# EasyEDA Pro project EasyArduino_2025-08-07.epro

# Schematic Schematic1
Board Name: Board1; Create Date: 2025-08-04; Page Name: P1; Project Name: EasyArduino; Schematic Name: Schematic1; Update Date: 2025-08-04; Company: EasyEDA.com; Page Size: A4; Version: V1.0
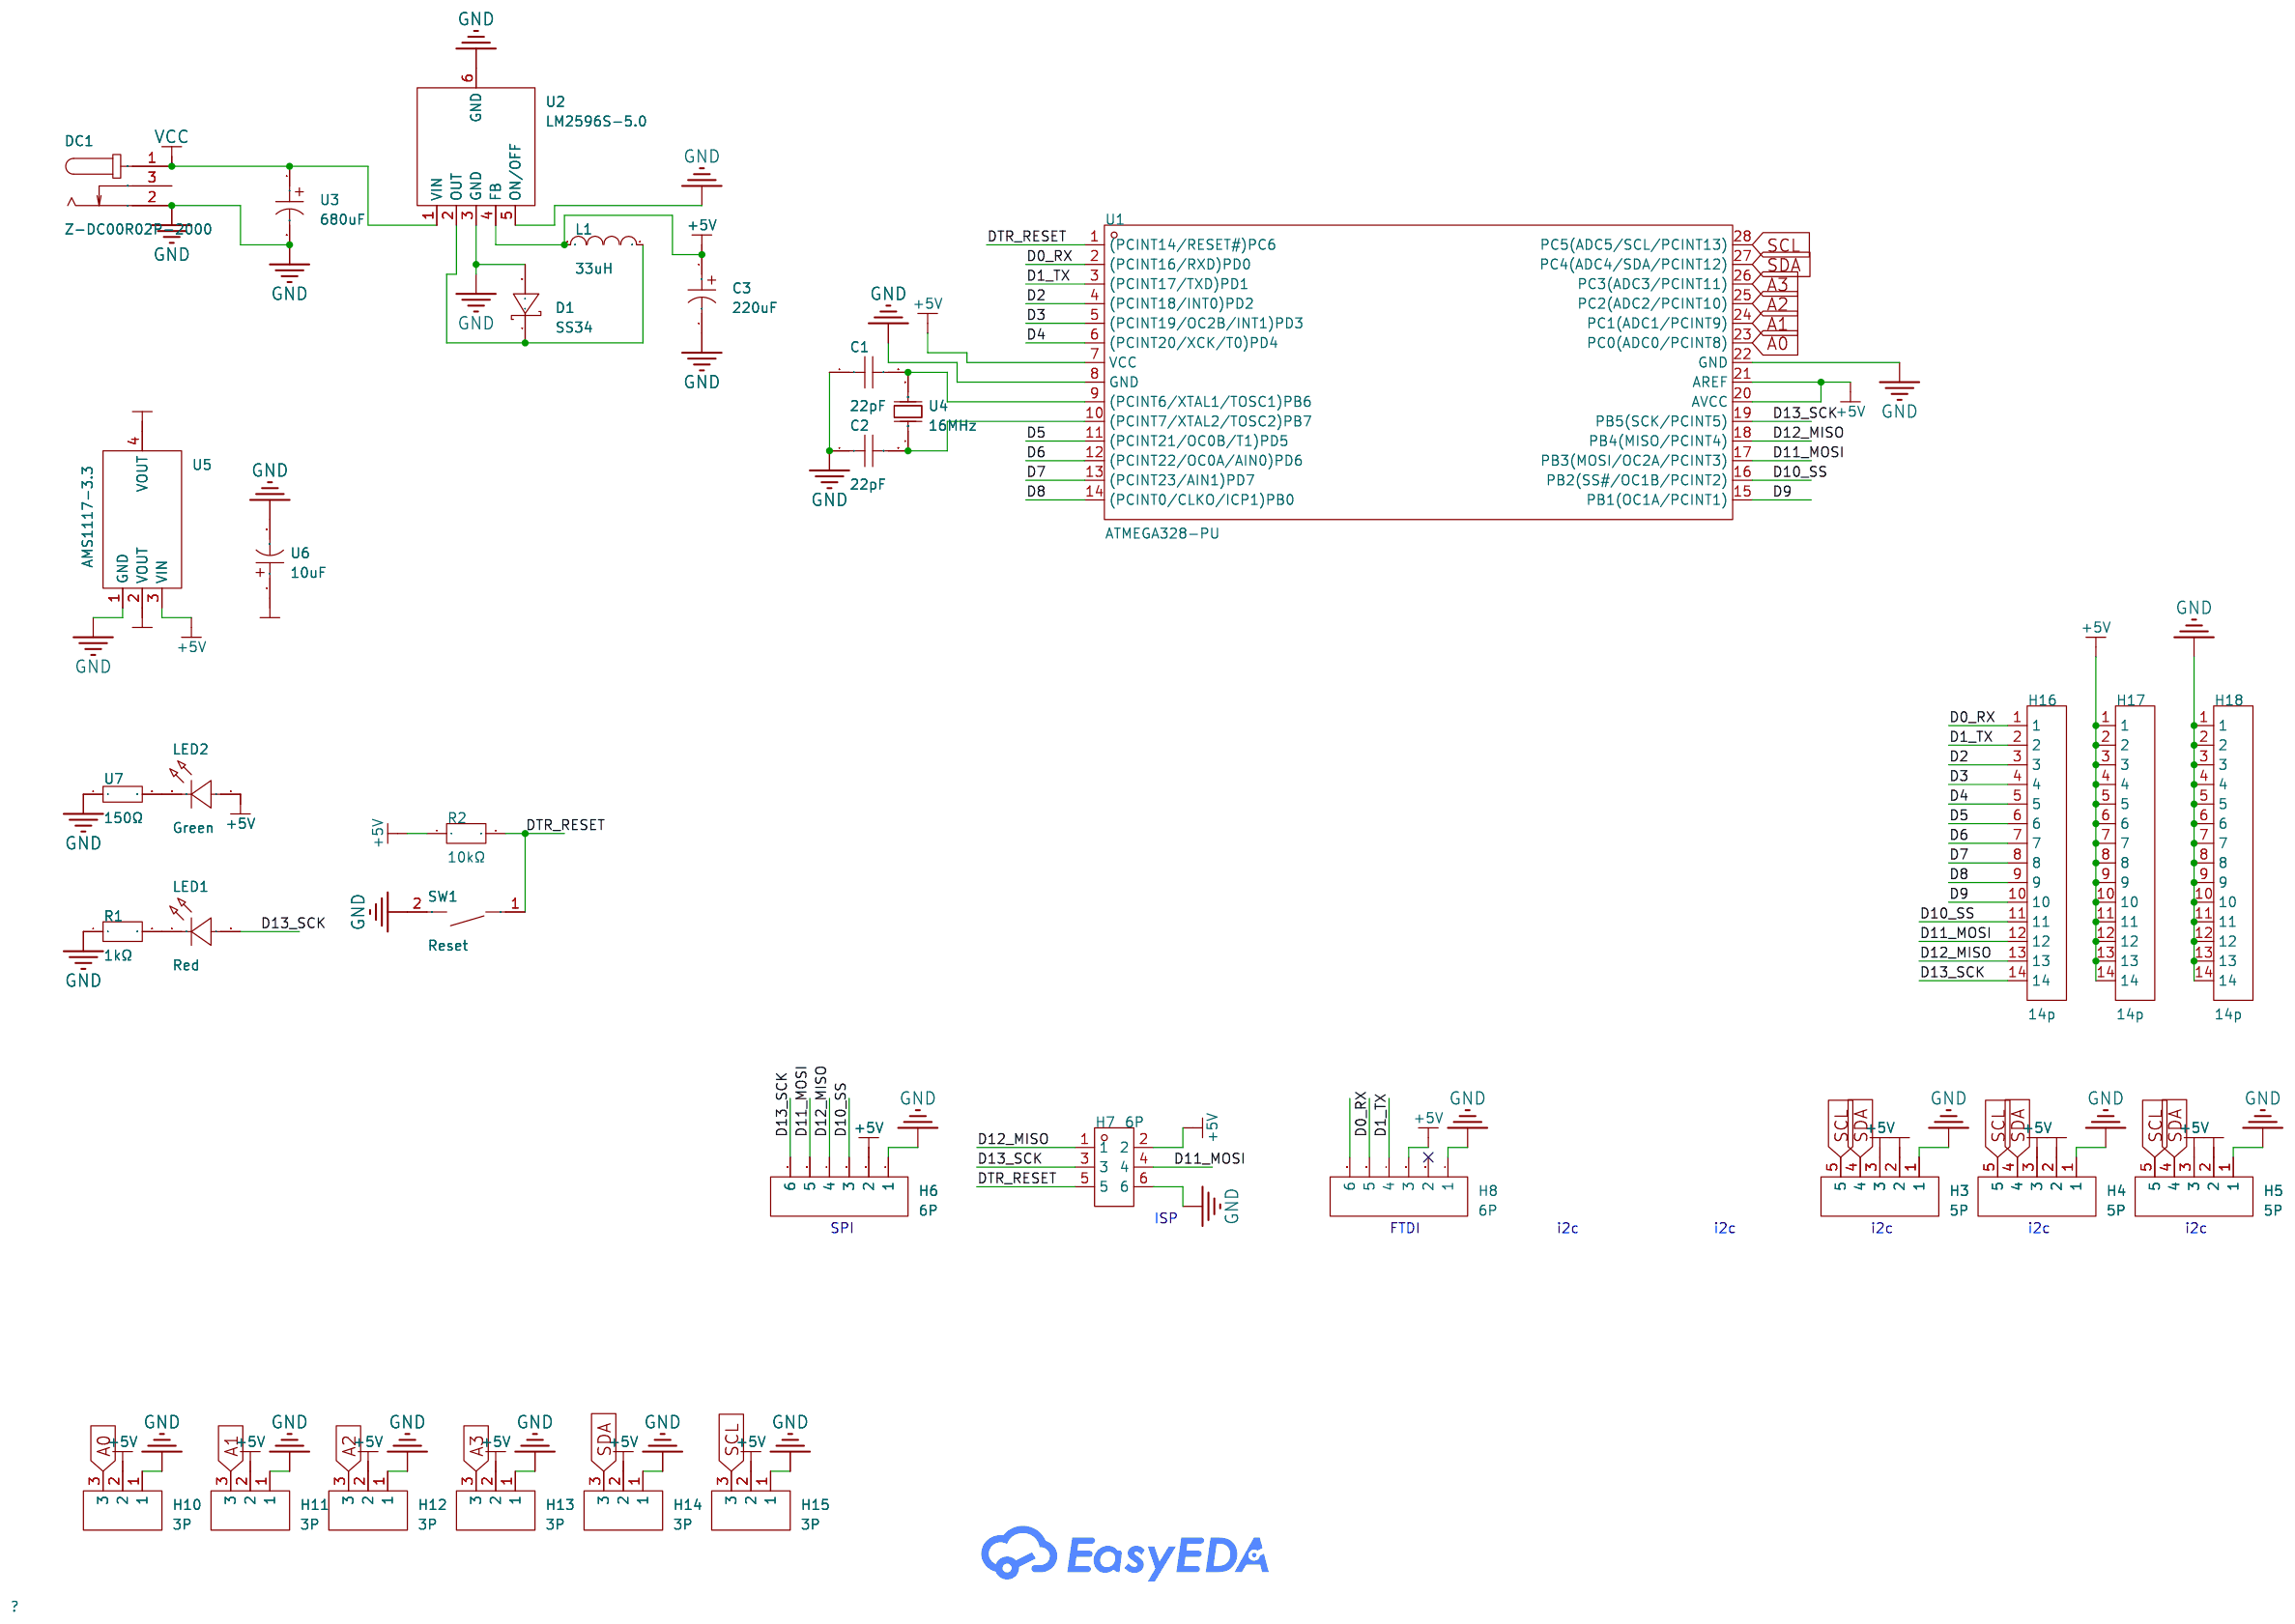
[diagram p0: schematic sheet]

## Parts
C1  22pF  [CAP-TH_L4.0-W2.6-P2.50-D0.5]
C2  22pF  [CAP-TH_L4.0-W2.6-P2.50-D0.5]
C3  220uF  [CAP-SMD_BD6.3-L6.6-W6.6-FD]
D1  SS34  [SMA_L4.4-W2.8-LS5.4-RD]
DC1  Z-DC00R02P-2000  [DC-IN-TH_DC005]
H3  5P  [HDR-TH_5P-P2.54-V-M]
H4  5P  [HDR-TH_5P-P2.54-V-M]
H5  5P  [HDR-TH_5P-P2.54-V-M]
H6  6P  [HDR-TH_6P-P2.54-V-M-1]
H7  6P  [HDR-TH_6P-P2.54-V-M-R2-C3-S2.54]
H8  6P  [HDR-TH_6P-P2.54-V-M-1]
H10  3P  [HDR-TH_3P-P2.54-V-M]
H11  3P  [HDR-TH_3P-P2.54-V-M]
H12  3P  [HDR-TH_3P-P2.54-V-M]
H13  3P  [HDR-TH_3P-P2.54-V-M]
H14  3P  [HDR-TH_3P-P2.54-V-M]
H15  3P  [HDR-TH_3P-P2.54-V-M]
H16  14p  [HDR-TH_14P-P2.54-V-M]
H17  14p  [HDR-TH_14P-P2.54-V-M]
H18  14p  [HDR-TH_14P-P2.54-V-M]
L1  33uH  [IND-SMD_L12.3-W12.3]
LED1  Red  [LED-TH_BD3.8-P2.54-RD]
LED2  Green  [LED-TH_BD3.8-P2.54-FD_GREEN]
R1  1kΩ  [RES-TH_BD2.7-L6.2-P10.20-D0.4]
R2  10kΩ  [RES-TH_BD2.4-L6.3-P10.30-D0.6]
SW1  Reset  [SW-SMD_L3.9-W3.0-P4.45]
U1  ATMEGA328-PU  [DIP-28_L35.0-W6.5-P2.54-LS7.6-BL]
U2  LM2596S-5.0  [TO-263-5_L10.2-W8.6-P1.70-LS14.4-BR]
U3  680uF  [CAP-SMD_BD10.0-L10.3-W10.3-LS11.6-FD]
U4  16MHz  [HC-49US_L11.0-W4.6-P4.88]
U5  AMS1117-3.3  [SOT-223-3_L6.5-W3.4-P2.30-LS7.0-BR]
U6  10uF  [CAP-SMD_BD4.0-L4.3-W4.3-FD-LS4.8]
U7  150Ω  [RES-TH_BD2.7-L6.2-P10.20-D0.4]

## Library data of the parts
C1 C2 = K220J15C0GF5TL2: Capacitance:22pF Tolerance:±5% Tolerance:±5% Voltage Rating:50V Temperature Coefficient:C0G; LCSC Part Name: 22pF ±5% 50V; Supplier Part: C2170230; Manufacturer: VISHAY(威世); Supplier Footprint: 插件,P=2.5mm; JLCPCB Part Class: Extended Part; Datasheet: https://atta.szlcsc.com/upload/public/pdf/source/20210702/6531D680143ED60327F22057485455BA.pdf; Supplier: LCSC; Tolerance: ±5%; Voltage Rating: 50V; Temperature Coefficient: C0G
C3 = 189RV0063: Capacitance:220uF Tolerance:±20% Tolerance:±20% Voltage Rating:16V Ripple Current:110mA Diameter:6.3mm Height - Seated (Max):7.7mm Lifetime:2000hrs@105℃ Operating Temperature:-55℃~+105℃ Operating Temperature:-55℃~+105℃; LCSC Part Name: 220uF ±20% 16V; Supplier Part: C18203143; Manufacturer: KNSCHA(科尼盛); Supplier Footprint: SMD,D6.3xL7.7mm; JLCPCB Part Class: Extended Part; Datasheet: https://atta.szlcsc.com/upload/public/pdf/source/20231020/6819E00089B8FE8D9330F875BB68A445.pdf; Supplier: LCSC; Tolerance: ±20%; Voltage Rating: 16V; Ripple Current: 110mA; Diameter: 6.3mm; Height - Seated (Max): 7.7mm; Lifetime: 2000hrs@105℃; Operating Temperature: -55℃~+105℃
D1 = SS34: Forward Voltage (Vf@If):500mV@3A Reverse Voltage (Vr):40V Average Rectified Current (Io):3A; LCSC Part Name: 电压:40V 电流:3A; Supplier Part: C142458; Supplier Footprint: SMA(DO-214AC); JLCPCB Part Class: Extended Part; Datasheet: https://atta.szlcsc.com/upload/public/pdf/source/20171114/C142458_15106326937931117548.pdf; Supplier: LCSC; Forward Voltage (Vf@If): 500mV@3A; Reverse Voltage (Vr): 40V; Average Rectified Current (Io): 3A
DC1 = Z-DC00R02P-2000: Inside Contact Diameter:2mm Outside Contact Diameter:6.3mm Current Rating (Max):500mA Voltage Rating (Max):30V; LCSC Part Name: 内径:2mm 外径:6.3mm; Supplier Part: C132516; Manufacturer: Ckmtw(灿科盟); Supplier Footprint: 插件; JLCPCB Part Class: Extended Part; Datasheet: https://atta.szlcsc.com/upload/public/pdf/source/20180105/C132516_15151572879811234526.pdf; Supplier: LCSC; Inside Contact Diameter: 2mm; Outside Contact Diameter: 6.3mm; Current Rating (Max): 500mA; Voltage Rating (Max): 30V
H3-H5 = PZ254V-11-05P: Pin Structure:1x5P Pitch:2.54mm Row Spacing:- Circluar Pins/Square Pins:Policy Mounting Type:Straight Number of Rows:Single Row Number of Pins:5P Current Rating:- Voltage Rating (Max):- Length of Mating Pin:6mm Insulation Height:2.5mm Length of End Connec; LCSC Part Name: 1x5P 间距:2.54mm 方针 直插; Supplier Part: C492404; Manufacturer: XFCN(兴飞); Supplier Footprint: 插件,P=2.54mm; JLCPCB Part Class: Extended Part; Datasheet: https://atta.szlcsc.com/upload/public/pdf/source/20200309/C492404_E51533260F8710EFF5D4617281164C1D.pdf; Supplier: LCSC; Pin Structure: 1x5P; Pitch: 2.54mm; Circluar Pins/Square Pins: Policy; Mounting Type: Straight; Number of Rows: Single Row; Length of Mating Pin: 6mm; Insulation Height: 2.5mm; Length of End Connection Pin: 3mm; Contact Material: Brass; Operating Temperature: -40℃~+105℃; Color: Black
H6 H8 = 2.54-1x6P直针: Pin Structure:1x6P Pitch:2.54mm Row Spacing:- Circluar Pins/Square Pins:Policy Mounting Type:Straight Number of Rows:Single Row Number of Pins:6P Current Rating:3A Voltage Rating (Max):- Length of Mating Pin:- Insulation Height:- Contact Material:Brass Co; LCSC Part Name: 1x6P 间距:2.54mm 方针 直插; Supplier Part: C37208; Manufacturer: BOOMELE(博穆精密); Supplier Footprint: 插件,P=2.54mm; JLCPCB Part Class: Extended Part; Datasheet: https://atta.szlcsc.com/upload/public/pdf/source/20250115/42A019761A40C8B839643401D8CA5A96.pdf; Supplier: LCSC; Pin Structure: 1x6P; Pitch: 2.54mm; Circluar Pins/Square Pins: Policy; Mounting Type: Straight; Number of Rows: Single Row; Current Rating: 3A; Contact Material: Brass; Operating Temperature: -40℃~+105℃; Color: Black
H7 = PZ254V-12-6P: Pin Structure:2x3P Pitch:2.54mm Row Spacing:2.54mm Circluar Pins/Square Pins:Square Pins Mounting Type:Straight Number of Rows:双排 Number of Pins:6P Current Rating (Max):- Voltage Rating (Max):- Length of Mating Pin:6mm Insulation Height:2.5mm Length of En; LCSC Part Name: 间距:2.54mm 2x3P 直插 方针; Supplier Part: C492420; Manufacturer: XFCN(兴飞); Supplier Footprint: 插件,P=2.54mm; JLCPCB Part Class: Extended Part; Datasheet: https://atta.szlcsc.com/upload/public/pdf/source/20200309/C492420_BAECB307B001054C09D200388220EAE6.pdf; Supplier: LCSC; Pin Structure: 2x3P; Pitch: 2.54mm; Row Spacing: 2.54mm; Circluar Pins/Square Pins: Square Pins; Mounting Type: Straight; Number of Rows: 双排; Length of Mating Pin: 6mm; Insulation Height: 2.5mm; Length of End Connection Pin: 3mm; Operating Temperature Range: -40℃~+105℃; Color: Black
H10-H15 = PZ254V-11-03P: Pin Structure:1x3P Pitch:2.54mm Row Spacing:- Circluar Pins/Square Pins:Policy Mounting Type:Straight Number of Rows:Single Row Number of Pins:3P Current Rating:3A Voltage Rating (Max):250V Length of Mating Pin:6mm Insulation Height:2.5mm Length of End Co; LCSC Part Name: 1x3P 间距:2.54mm 方针 直插; Supplier Part: C2937625; Manufacturer: XFCN(兴飞); Supplier Footprint: 插件,P=2.54mm; JLCPCB Part Class: Extended Part; Datasheet: https://atta.szlcsc.com/upload/public/pdf/source/20200309/C492402_8335C3D49C4E4C618838D59BB1D024C1.pdf; Supplier: LCSC; Pin Structure: 1x3P; Pitch: 2.54mm; Circluar Pins/Square Pins: Policy; Mounting Type: Straight; Number of Rows: Single Row; Current Rating: 3A; Voltage Rating (Max): 250V; Length of Mating Pin: 6mm; Insulation Height: 2.5mm; Length of End Connection Pin: 3mm; Operating Temperature: -40℃~+105℃; Color: Black
H16-H18 = PZ254-1-14-Z-8.5: Pin Structure:1x14P Pitch:2.54mm Row Spacing:- Circluar Pins/Square Pins:Policy Mounting Type:Straight Number of Rows:Single Row Number of Pins:14P Current Rating:3A Voltage Rating (Max):- Length of Mating Pin:6mm Insulation Height:2.5mm Length of End Con; LCSC Part Name: 1x14P 间距:2.54mm 方针 直插; Supplier Part: C2894937; Manufacturer: HCTL(华灿天禄); Supplier Footprint: 插件,P=2.54mm; JLCPCB Part Class: Extended Part; Datasheet: https://atta.szlcsc.com/upload/public/pdf/source/20240305/0F0A2A5C422E5D195558C9C26715A031.pdf; Supplier: LCSC; Pin Structure: 1x14P; Pitch: 2.54mm; Circluar Pins/Square Pins: Policy; Mounting Type: Straight; Number of Rows: Single Row; Number of Pins: 14P; Current Rating: 3A; Length of Mating Pin: 6mm; Insulation Height: 2.5mm; Length of End Connection Pin: 3mm; Contact Material: Brass; Operating Temperature: -40℃~+105℃; Color: Black
L1 = SMDRI127-330MT: Inductance: Tolerance:±20% Tolerance:±20% Rated Current: Saturation Current (Isat):5.5A DC Resistance (DCR): Type:屏蔽电感; LCSC Part Name: 33uH ±20% 5.5A; Supplier Part: C9400; Manufacturer: SXN(顺翔诺); Supplier Footprint: SMD,12.3x12.3mm; JLCPCB Part Class: Extended Part; Datasheet: https://atta.szlcsc.com/upload/public/pdf/source/20210810/6F96FDC19AA308DD2AD166FFB9640E87.pdf; Supplier: LCSC; Tolerance: ±20%; Saturation Current (Isat): 5.5A; Type: 屏蔽电感
LED1 = XL-302SURD: Lamp Holder Type:3mm圆形灯头 Emitted Color:Red Power Dissipation:80mW Forward Current:30mA Dominant Wavelength:615nm~620nm Dominant Wavelength:615nm~620nm Peak Wavelength:625nm Lens Color:红色透镜 Color Temperature:- Color Temperature:- Viewing Angle:50° Mounting; Supplier Part: C2895470; Manufacturer: XINGLIGHT(成兴光); Supplier Footprint: 插件,D=3mm; JLCPCB Part Class: Extended Part; Datasheet: https://atta.szlcsc.com/upload/public/pdf/source/20240112/E1E2B82945FD635E4907401DDE6D4922.pdf; Supplier: LCSC; Lamp Holder Type: 3mm圆形灯头; Power Dissipation: 80mW; Forward Current: 30mA; Dominant Wavelength: 615nm~620nm; Peak Wavelength: 625nm; Lens Color: 红色透镜; Viewing Angle: 50°; Operating Temperature: -25℃~+85℃
LED2 = XL-302UGD: Lamp Holder Type:3mm圆形灯头 Emitted Color:Emerald Power Dissipation:80mW Forward Current:30mA Dominant Wavelength:510nm~520nm Dominant Wavelength:510nm~520nm Peak Wavelength:525nm Lens Color:绿色透镜 Color Temperature:- Color Temperature:- Viewing Angle:50° Moun; Supplier Part: C2895476; Manufacturer: XINGLIGHT(成兴光); Supplier Footprint: 插件,D=3mm; JLCPCB Part Class: Extended Part; Datasheet: https://atta.szlcsc.com/upload/public/pdf/source/20240112/A4C1FE2F91E20BD07CDB872CEF78D7A0.pdf; Supplier: LCSC; Lamp Holder Type: 3mm圆形灯头; Emitted Color: Emerald; Power Dissipation: 80mW; Forward Current: 30mA; Dominant Wavelength: 510nm~520nm; Peak Wavelength: 525nm; Lens Color: 绿色透镜; Viewing Angle: 50°; Operating Temperature: -25℃~+85℃
R1 = MF1/4W-1K±1%-ST52: Type:Metal Film Resistor Resistance:1kΩ Tolerance:±1% Tolerance:±1% Voltage-Supply(Max):250V Power(Watts):250mW Temperature Coefficient:±100ppm/℃ Temperature Coefficient:±100ppm/℃ Operating Temperature:-55℃~+155℃ Operating Temperature:-55℃~+155℃; LCSC Part Name: 金属膜电阻 1kΩ ±1% 250mW; Supplier Part: C2903245; Manufacturer: VO(翔胜); Supplier Footprint: 插件,D2.7xL6.2mm; JLCPCB Part Class: Extended Part; Datasheet: https://atta.szlcsc.com/upload/public/pdf/source/20241217/72FEFC4F99972FE0FB9B38B807463E29.pdf; Supplier: LCSC; Type: Metal Film Resistor; Tolerance: ±1%; Voltage-Supply(Max): 250V; Power(Watts): 250mW; Temperature Coefficient: ±100ppm/℃; Operating Temperature: -55℃~+155℃
R2 = RN1/4W10KFT/BA1: Type:Metal Film Resistors Resistance:10kΩ Tolerance:±1% Tolerance:±1% Voltage-Supply(Max):250V Power(Watts):250mW Temperature Coefficient:±50ppm/℃ Temperature Coefficient:±50ppm/℃ Operating Temperature:-55℃~+125℃ Operating Temperature:-55℃~+125℃; LCSC Part Name: 10kΩ ±1% 250mW 金属膜电阻; Supplier Part: C410695; Manufacturer: Tyohm(幸亚电阻); Supplier Footprint: 插件,D2.4xL6.5mm; JLCPCB Part Class: Extended Part; Datasheet: https://atta.szlcsc.com/upload/public/pdf/source/20250211/2C0505E212032D72CE625B2E6B5197BA.pdf; Supplier: LCSC; Type: Metal Film Resistors; Tolerance: ±1%; Voltage-Supply(Max): 250V; Power(Watts): 250mW; Temperature Coefficient: ±50ppm/℃; Operating Temperature: -55℃~+125℃
SW1 = TS-1088-AR02016: Circuit:SPST Actuator Style:Round Button Operating Force:160gf Mounting Style:Brick nogging Switch Length:4mm Switch Width:3mm Switch Height:2mm Strike Gundam:不带 Contact Current:50mA Voltage Rating (DC):12V Insulation Resistance:100MΩ Actuator/Cap Color:B; LCSC Part Name: 4*3*2mm 立贴 轻触开关; Supplier Part: C720477; Manufacturer: XUNPU(讯普); Supplier Footprint: SMD; JLCPCB Part Class: Basic Part; Datasheet: https://atta.szlcsc.com/upload/public/pdf/source/20200810/C720475_60D09DD6C54279ADDB2DC25100F1CC11.pdf; Supplier: LCSC; Circuit: SPST; Actuator Style: Round Button; Operating Force: 160gf; Mounting Style: Brick nogging; Switch Length: 4mm; Switch Width: 3mm; Switch Height: 2mm; Strike Gundam: 不带; Contact Current: 50mA; Voltage Rating (DC): 12V; Insulation Resistance: 100MΩ; Actuator/Cap Color: Black; Pin Style: SMDSplicing; Mechanical Life: 10万次; Operating Temperature: -30℃~+80℃
U1 = ATMEGA328-PU: CPU Core:AVR CPU Maximum Speed:20MHz Program Storage Size:32KB Number of I/O:23 ADC (Bit):10bit Voltage - Supply:1.8V~5.5V Voltage - Supply:1.8V~5.5V Applications:-; LCSC Part Name: 基于AVR增强型RISC架构的低功耗CMOS 8位微控制器; Supplier Part: C613508; Manufacturer: MICROCHIP(美国微芯); Supplier Footprint: PDIP-28; JLCPCB Part Class: Extended Part; Datasheet: https://atta.szlcsc.com/upload/public/pdf/source/20210120/C613508_D57921F38AD005C89F39DE8123071AEB.pdf; Supplier: LCSC; CPU Core: AVR; CPU Maximum Speed: 20MHz; Program Storage Size: 32KB; Number of I/O: 23; ADC (Bit): 10bit; Voltage - Supply: 1.8V~5.5V
U2 = LM2596S-5.0_C19631823: Function:Buck Output Type:Fixed Voltage - Supply:4.5V~40V Voltage - Supply:4.5V~40V Output Voltage:5V Output Voltage:5V Output Current:3A Frequency - Switching:150kHz Frequency - Switching:150kHz Operating Temperature:-20℃~+70℃ Operating Temperature:-20℃~; Supplier Part: C19631823; Manufacturer: GR(国睿); Supplier Footprint: TO-263-5L; JLCPCB Part Class: Extended Part; Datasheet: https://atta.szlcsc.com/upload/public/pdf/source/20231222/C0C0FA2F27B9A861FEC2D8068E50B0DA.pdf; Supplier: LCSC; Function: Buck; Output Type: Fixed; Voltage - Supply: 4.5V~40V; Output Voltage: 5V; Output Current: 3A; Frequency - Switching: 150kHz; Operating Temperature: -20℃~+70℃; Synchronous Rectifier: No; Number of Outputs: 1; Topology: Buck; Quiescent Current: 2mA; Switch tube (built-in/external): Built-in
U3 = RVT1E681M1010: Capacitance:680uF Tolerance:±20% Tolerance:±20% Voltage Rating:25V Ripple Current:354mA@120Hz Diameter:10mm Height - Seated (Max):10.2mm Lifetime:2000hrs@105℃ Operating Temperature:-40℃~+105℃ Operating Temperature:-40℃~+105℃; LCSC Part Name: 680uF ±20% 25V; Supplier Part: C5221838; Manufacturer: ROQANG(容强); Supplier Footprint: SMD,D10xL10.2mm; Datasheet: https://atta.szlcsc.com/upload/public/pdf/source/20221109/46DADBB288331D3648F8017E82A16C7C.pdf; Supplier: LCSC; Tolerance: ±20%; Voltage Rating: 25V; Ripple Current: 354mA@120Hz; Diameter: 10mm; Height - Seated (Max): 10.2mm; Lifetime: 2000hrs@105℃; Operating Temperature: -40℃~+105℃
U4 = 49SAC16000222060: Crystal Type:直插晶振 Frequency: Normal temperature Frequency Tolerance:±20ppm Normal temperature Frequency Tolerance:±20ppm External load capacitor: Frequency Stability(Full temperature range):±30ppm Frequency Stability(Full temperature range):±30ppm Equival; LCSC Part Name: 16MHz ±20ppm 22pF; Supplier Part: C443539; Manufacturer: JGHC(晶光华); Supplier Footprint: HC-49S; JLCPCB Part Class: Extended Part; Datasheet: https://atta.szlcsc.com/upload/public/pdf/source/20191118/C443544_FEE5A62AFE1FD73D91893808184C550C.pdf; Supplier: LCSC; Crystal Type: 直插晶振; Normal temperature Frequency Tolerance: ±20ppm; Frequency Stability(Full temperature range): ±30ppm; Equivalent Series Resistance (ESR): 60Ω
U5 = AMS1117-3.3_C6186: Output Type:Fixed Voltage - Supply:16V Output Voltage:3.3V Output Voltage:3.3V Output Current:1A Power Supply Rejection Ratio (PSRR):72dB@(120Hz) Voltage Dropout:1.1V@(800mA) standby current:5mA Noise:- Features:Over Current Protection；Over Temperature Pr; LCSC Part Name: 输出3.3V 1A; Supplier Part: C6186; Manufacturer: AMS; Supplier Footprint: SOT-223; JLCPCB Part Class: Basic Part; Datasheet: https://atta.szlcsc.com/upload/public/pdf/source/20180727/C6186_7A095716F0823C02F1997A905E26C086.pdf; Supplier: LCSC; Output Type: Fixed; Voltage - Supply: 16V; Output Voltage: 3.3V; Output Current: 1A; Power Supply Rejection Ratio (PSRR): 72dB@(120Hz); Voltage Dropout: 1.1V@(800mA); standby current: 5mA; Features: Over Current Protection；Over Temperature Protection; Operating Temperature: -40℃~+125℃; Output Configuration: Positive; Number of Outputs: 1
U6 = UUQ1A100MCL1GB: Capacitance:10uF Tolerance:±20% Tolerance:±20% Voltage Rating:10V Ripple Current:22mA@120Hz Diameter:- Height - Seated (Max):- Lifetime:1000hrs@105℃ Operating Temperature:-40℃~+105℃ Operating Temperature:-40℃~+105℃; LCSC Part Name: 10uF ±20% 10V; Supplier Part: C2164812; Manufacturer: Nichicon(尼吉康); Supplier Footprint: SMD,D4xL5.4mm; JLCPCB Part Class: Extended Part; Datasheet: https://atta.szlcsc.com/upload/public/pdf/source/20211207/38B44A7051016EAD1B5AFFFA9352DFFB.pdf; Supplier: LCSC; Tolerance: ±20%; Voltage Rating: 10V; Ripple Current: 22mA@120Hz; Lifetime: 1000hrs@105℃; Operating Temperature: -40℃~+105℃
U7 = KNP1WS-150Ω±5%-XT52: Type:Wirewound Resistors Resistance: Tolerance:±5% Tolerance:±5% Overload Voltage (Max):350V Power(Watts):1W Temperature Coefficient:±350ppm/℃ Temperature Coefficient:±350ppm/℃ Operating Temperature Range:-55℃~+155℃ Operating Temperature Range:-55℃~+155℃; LCSC Part Name: 绕线电阻 150Ω ±5% 1W; Supplier Part: C479230; Manufacturer: VO(翔胜); Supplier Footprint: 插件,D3.5xL9mm; JLCPCB Part Class: Extended Part; Datasheet: https://atta.szlcsc.com/upload/public/pdf/source/20200609/C601736_823D5FEC32C33ED68EDB1181C52D1F38.pdf; Supplier: LCSC; Type: Wirewound Resistors; Tolerance: ±5%; Overload Voltage (Max): 350V; Power(Watts): 1W; Temperature Coefficient: ±350ppm/℃; Operating Temperature Range: -55℃~+155℃

## Nets
+5V: C3.1 H3.3 H4.3 H5.3 H6.2 H7.2 H8.3 H10.2 H11.2 H12.2 H13.2 H14.2 H15.2 H17.1 H17.2 H17.3 H17.4 H17.5 H17.6 H17.7 H17.8 H17.9 H17.10 H17.11 H17.12 H17.13 H17.14 L1.1 LED2.1(A) R2.1 U1.7(VCC) U1.20(AVCC) U1.21(AREF) U2.4(FB) U5.3(VIN)
GND: C1.1 C2.1 C3.2 D1.2(A) DC1.2 H3.1 H4.1 H5.1 H6.1 H7.6 H8.1 H10.1 H11.1 H12.1 H13.1 H14.1 H15.1 H18.1 H18.2 H18.3 H18.4 H18.5 H18.6 H18.7 H18.8 H18.9 H18.10 H18.11 H18.12 H18.13 H18.14 R1.1 SW1.2 U1.8(GND) U1.22(GND) U2.3(GND) U2.5(ON/OFF) U2.6(GND) U3.2 U5.1(GND) U6.2 U7.1
VCC: DC1.1 U2.1(VIN) U3.1
+3.3: H3.2 H4.2 H5.2 U5.2(VOUT) U5.4(VOUT) U6.1
A0: H10.3 U1.23(PC0(ADC0/PCINT8))
A1: H11.3 U1.24(PC1(ADC1/PCINT9))
A2: H12.3 U1.25(PC2(ADC2/PCINT10))
A3: H13.3 U1.26(PC3(ADC3/PCINT11))
D0_RX: H8.5 H16.1 U1.2((PCINT16/RXD)PD0)
D1_TX: H8.4 H16.2 U1.3((PCINT17/TXD)PD1)
D2: H16.3 U1.4((PCINT18/INT0)PD2)
D3: H16.4 U1.5((PCINT19/OC2B/INT1)PD3)
D4: H16.5 U1.6((PCINT20/XCK/T0)PD4)
D5: H16.6 U1.11((PCINT21/OC0B/T1)PD5)
D6: H16.7 U1.12((PCINT22/OC0A/AIN0)PD6)
D7: H16.8 U1.13((PCINT23/AIN1)PD7)
D8: H16.9 U1.14((PCINT0/CLKO/ICP1)PB0)
D9: H16.10 U1.15(PB1(OC1A/PCINT1))
D10_SS: H6.3 H16.11 U1.16(PB2(SS#/OC1B/PCINT2))
D11_MOSI: H6.5 H7.4 H16.12 U1.17(PB3(MOSI/OC2A/PCINT3))
D12_MISO: H6.4 H7.1 H16.13 U1.18(PB4(MISO/PCINT4))
D13_SCK: H6.6 H7.3 H16.14 LED1.2(A) U1.19(PB5(SCK/PCINT5))
DTR_RESET: H7.5 R2.2 SW1.1 U1.1((PCINT14/RESET#)PC6)
SCL: H3.5 H4.5 H5.5 H15.3 U1.28(PC5(ADC5/SCL/PCINT13))
SDA: H3.4 H4.4 H5.4 H14.3 U1.27(PC4(ADC4/SDA/PCINT12))
$1N1105: D1.1(K) L1.2 U2.2(OUT)
$1N3764: C2.2 U1.10((PCINT7/XTAL2/TOSC2)PB7) U4.1(OSC1)
$1N3766: C1.2 U1.9((PCINT6/XTAL1/TOSC1)PB6) U4.2(OSC2)
$1N5673: LED2.2(K) U7.2
$1N5768: LED1.1(K) R1.2

Not connected (* = marked no-connect by the designer): DC1 3; H8 2* 6

## Notes on the sheet
- SPI
- ISP
- FTDI
- i2c
- i2c
- i2c
- i2c
- i2c

# Board PCB1
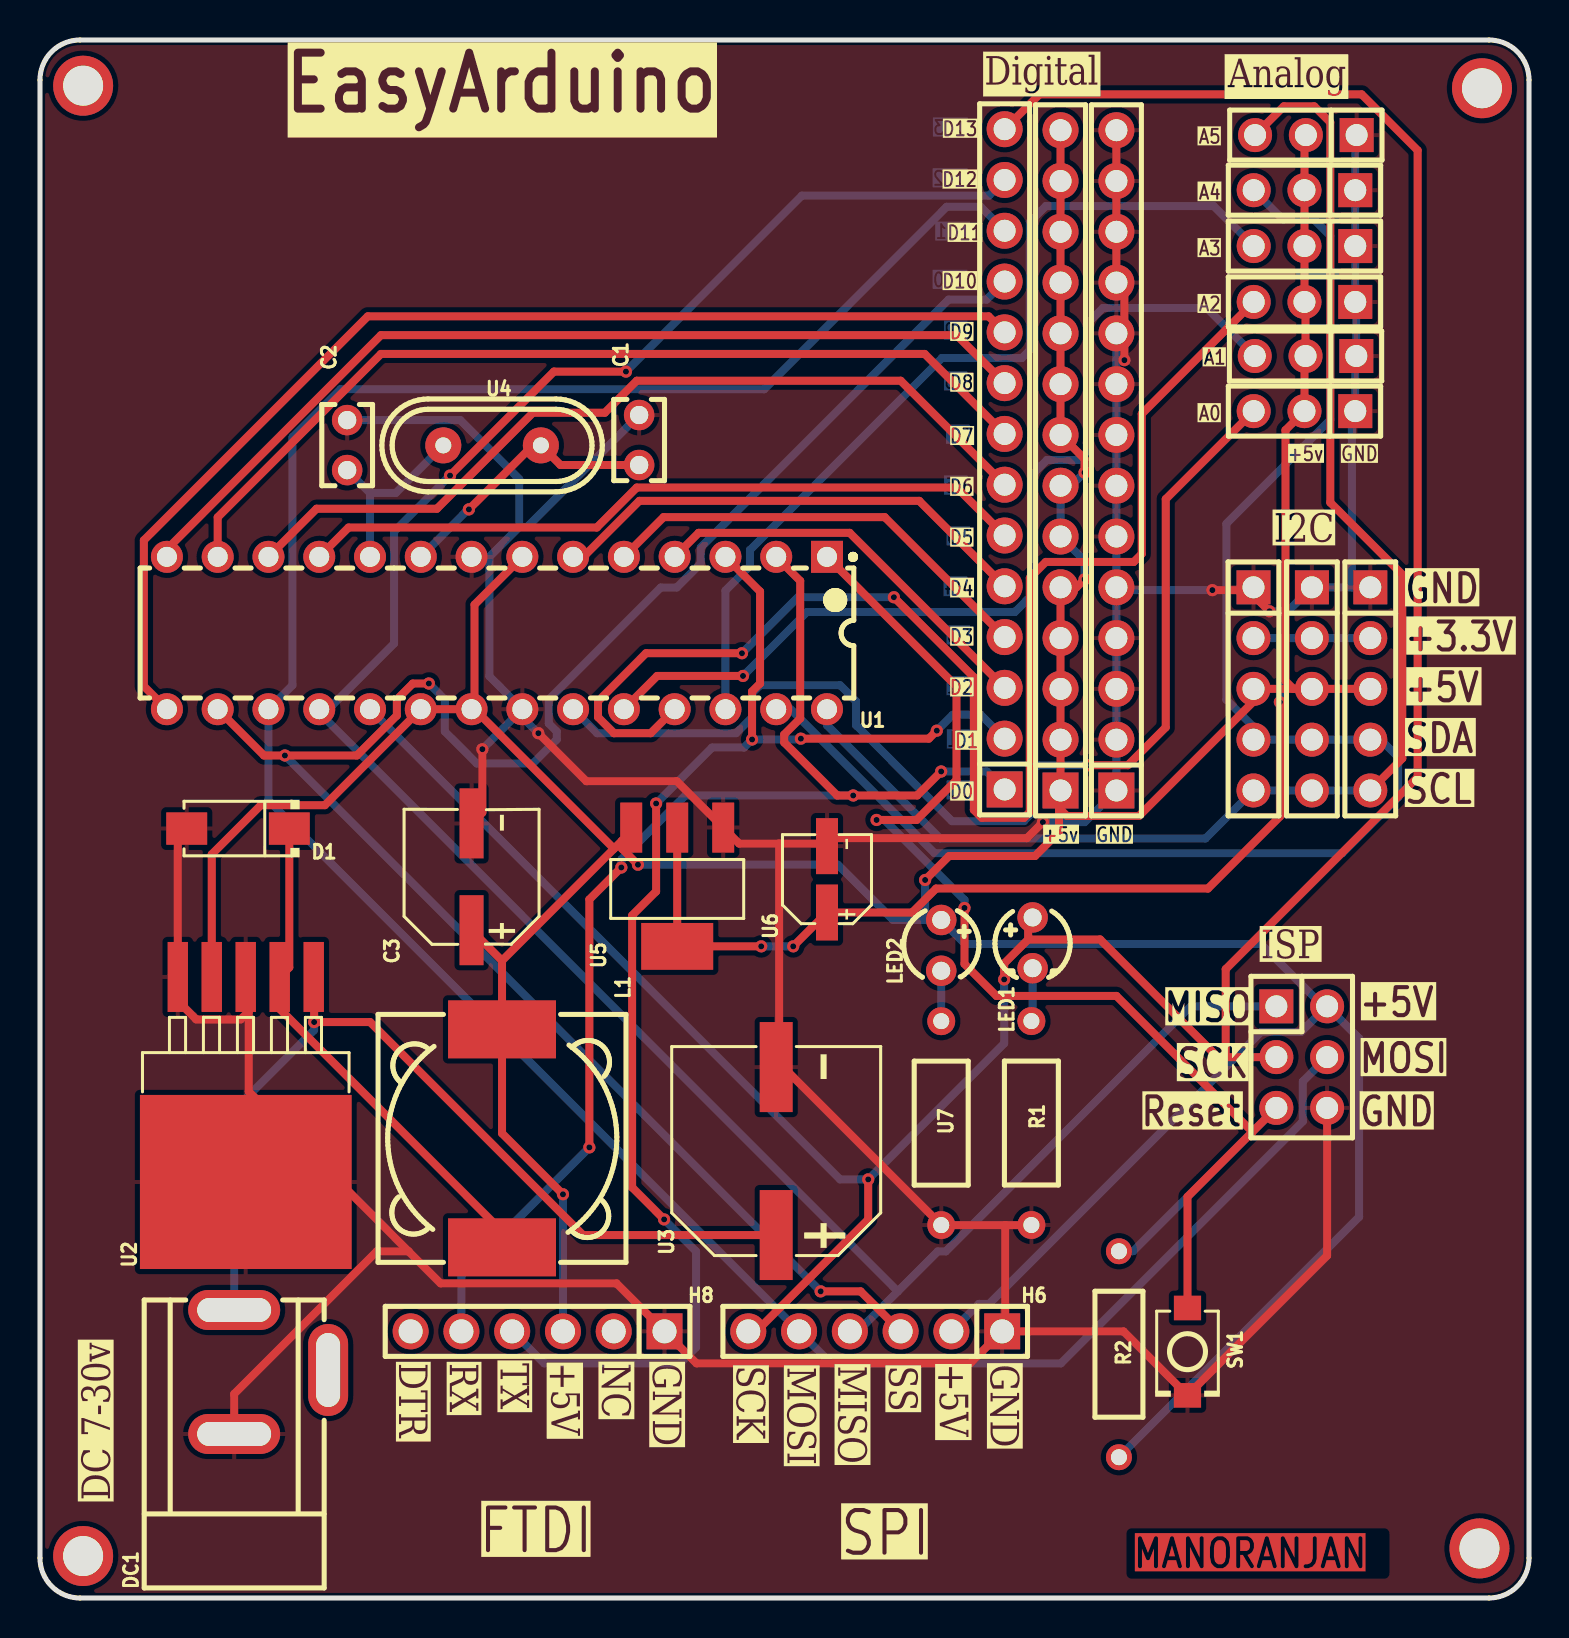
[diagram p1: board, top side]
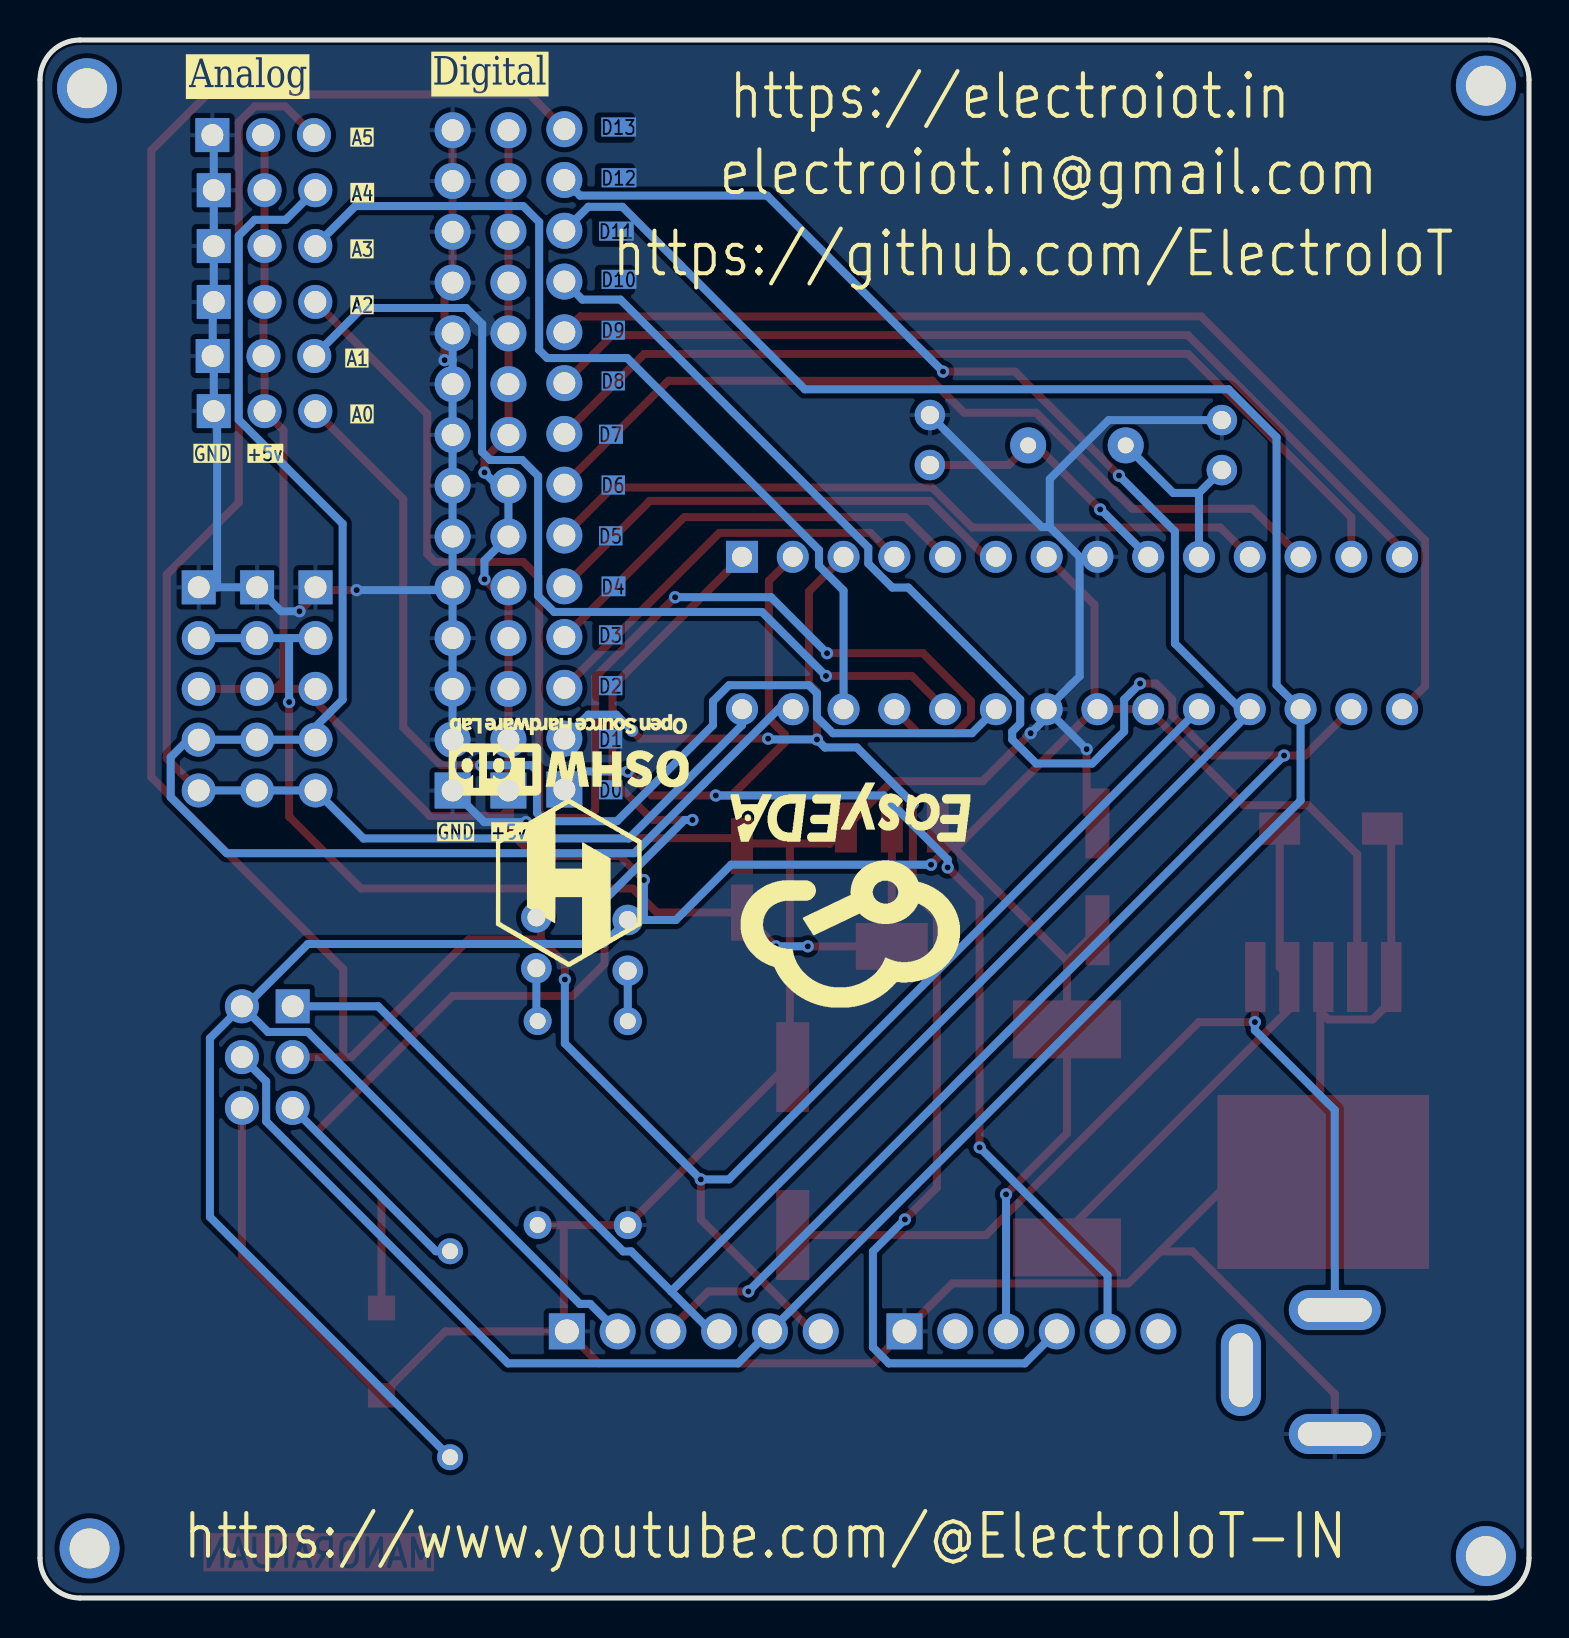
[diagram p2: board, bottom side, seen from below]

Outline 74.49 x 77.92 mm; copper layers: Top Layer, Bottom Layer. Coordinates in mm from the lower left corner of the outline.
Outline path: 0,75.92 arc(0.59,77.33) 2,77.92 72.49,77.92 arc(73.9,77.33) 74.49,75.92 74.49,2 arc(73.9,0.59) 72.49,0 2,0 arc(0.59,0.59) 0,2 0,75.92
Stack: Top Layer 0.035mm / Dielectric1 1.51mm FR4 er 4.5 / Bottom Layer 0.035mm

## Design rules (mm)
template: Custom Config
spacing copperThickness1oz (default): track to track 0.102, other pairs 0.152 to 0.3
spacing copperThickness2oz: track to track 0.203, other pairs 0.152 to 0.3
track width copperThickness1oz (default): min 0.127, default 0.4, max 2.54
track width copperThickness2oz: min 0.203, default 0.254, max 2.54
differential pair differentialPair (default): width min 0.127, default 0.254, max 2.54; gap min 0.152, default 0.152
via viaSize (default): diameter min 0.5, default 0.61, max 10; hole min 0.3, default 0.305, max 6.3

## Placement (name value [footprint] x y rotation side)
C1  22pF  [CAP-TH_L4.0-W2.6-P2.50-D0.5]  29.97 57.91 270 top
C2  22pF  [CAP-TH_L4.0-W2.6-P2.50-D0.5]  15.37 57.66 270 top
C3  220uF  [CAP-SMD_BD6.3-L6.6-W6.6-FD]  21.59 36.07 90 top
D1  SS34  [SMA_L4.4-W2.8-LS5.4-RD]  9.91 38.48 180 top
DC1  Z-DC00R02P-2000  [DC-IN-TH_DC005]  12.06 11.3 90 top
H3  5P  [HDR-TH_5P-P2.54-V-M]  66.55 45.47 270 top
H4  5P  [HDR-TH_5P-P2.54-V-M]  63.63 45.47 270 top
H5  5P  [HDR-TH_5P-P2.54-V-M]  60.71 45.47 270 top
H6  6P  [HDR-TH_6P-P2.54-V-M-1]  41.78 13.34 180 top
H7  6P  [HDR-TH_6P-P2.54-V-M-R2-C3-S2.54]  63.12 27.05 270 top
H8  6P  [HDR-TH_6P-P2.54-V-M-1]  24.89 13.34 180 top
H10  3P  [HDR-TH_3P-P2.54-V-M]  63.26 59.36 180 top
H11  3P  [HDR-TH_3P-P2.54-V-M]  63.31 62.11 180 top
H12  3P  [HDR-TH_3P-P2.54-V-M]  63.26 64.82 180 top
H13  3P  [HDR-TH_3P-P2.54-V-M]  63.26 67.61 180 top
H14  3P  [HDR-TH_3P-P2.54-V-M]  63.26 70.41 180 top
H15  3P  [HDR-TH_3P-P2.54-V-M]  63.33 73.16 180 top
H16  14p  [HDR-TH_14P-P2.54-V-M]  48.26 56.95 90 top
H17  14p  [HDR-TH_14P-P2.54-V-M]  51.05 56.9 90 top
H18  14p  [HDR-TH_14P-P2.54-V-M]  53.85 56.9 90 top
L1  33uH  [IND-SMD_L12.3-W12.3]  23.11 22.99 270 top
LED1  Red  [LED-TH_BD3.8-P2.54-RD]  49.66 32.77 90 top
LED2  Green  [LED-TH_BD3.8-P2.54-FD_GREEN]  45.08 32.64 270 top
NOREF  -  [Pad_e41]  72.14 75.51 0 top
NOREF#2  -  [Pad_e42]  72.01 2.48 0 top
NOREF#3  -  [Pad_e40]  2.16 75.63 0 top
NOREF#4  -  [Pad_e36]  2.16 2.1 0 top
R1  1kΩ  [RES-TH_BD2.7-L6.2-P10.20-D0.4]  49.59 23.75 90 top
R2  10kΩ  [RES-TH_BD2.4-L6.3-P10.30-D0.6]  53.97 12.19 90 top
SW1  Reset  [SW-SMD_L3.9-W3.0-P4.45]  57.4 12.32 270 top
U1  ATMEGA328-PU  [DIP-28_L35.0-W6.5-P2.54-LS7.6-BL]  22.86 48.26 180 top
U2  LM2596S-5.0  [TO-263-5_L10.2-W8.6-P1.70-LS14.4-BR]  10.29 25.93 90 top
U3  680uF  [CAP-SMD_BD10.0-L10.3-W10.3-LS11.6-FD]  36.83 22.35 90 top
U4  16MHz  [HC-49US_L11.0-W4.6-P4.88]  22.62 57.64 0 top
U5  AMS1117-3.3  [SOT-223-3_L6.5-W3.4-P2.30-LS7.0-BR]  31.88 35.56 90 top
U6  10uF  [CAP-SMD_BD4.0-L4.3-W4.3-FD-LS4.8]  39.37 35.94 90 top
U7  150Ω  [RES-TH_BD2.7-L6.2-P10.20-D0.4]  45.08 23.75 90 top

## Footprints (pads in the part's own frame, mm; a bottom-side part is the same pattern mirrored in y, then rotated)
CAP-SMD_BD4.0-L4.3-W4.3-FD-LS4.8
  rect 2.8x1.1 smd: 1(-1.661,0) 2(1.661,0)
CAP-SMD_BD6.3-L6.6-W6.6-FD
  rect 3.5x1.2 smd: 1(-2.67,0) 2(2.67,0)
CAP-SMD_BD10.0-L10.3-W10.3-LS11.6-FD
  rect 4.5x1.65 smd: 1(-4.2,0) 2(4.2,0)
CAP-TH_L4.0-W2.6-P2.50-D0.5
  round 1.524 hole 0.914: 1(-1.25,0) 2(1.25,0)
DC-IN-TH_DC005
  oval 2x4.6 hole 1.2x3.7: 1(3.1,2.35) 2(-3.1,2.35)
  oval 4.6x2 hole 3.7x1.2: 3(0.1,-2.35)
DIP-28_L35.0-W6.5-P2.54-LS7.6-BL
  rect 1.6x1.6 hole 1: 1(-16.51,-3.81)
  round 1.6 hole 1: 2(-13.97,-3.81) 3(-11.43,-3.81) 4(-8.89,-3.81) 5(-6.35,-3.81) 6(-3.81,-3.81) 7(-1.27,-3.81) 8(1.27,-3.81) 9(3.81,-3.81) 10(6.35,-3.81) 11(8.89,-3.81) 12(11.43,-3.81) 13(13.97,-3.81) 14(16.51,-3.81) 15(16.51,3.81) 16(13.97,3.81) 17(11.43,3.81) 18(8.89,3.81) 19(6.35,3.81) 20(3.81,3.81) 21(1.27,3.81) 22(-1.27,3.81) 23(-3.81,3.81) 24(-6.35,3.81) 25(-8.89,3.81) 26(-11.43,3.81) 27(-13.97,3.81) 28(-16.51,3.81)
HC-49US_L11.0-W4.6-P4.88
  round 1.8 hole 0.8: 1(-2.44,0) 2(2.44,0)
HDR-TH_3P-P2.54-V-M
  rect 1.7x1.7 hole 1.1: 1(-2.54,0)
  round 1.7 hole 1.1: 2(0,0) 3(2.54,0)
HDR-TH_5P-P2.54-V-M
  rect 1.7x1.7 hole 1.1: 1(-5.08,0)
  round 1.7 hole 1.1: 2(-2.54,0) 3(0,0) 4(2.54,0) 5(5.08,0)
HDR-TH_6P-P2.54-V-M-1
  rect 1.8x1.8 hole 1.2: 1(-6.35,0)
  round 1.8 hole 1.2: 2(-3.81,0) 3(-1.27,0) 4(1.27,0) 5(3.81,0) 6(6.35,0)
HDR-TH_6P-P2.54-V-M-R2-C3-S2.54
  rect 1.7x1.7 hole 1.1: 1(-2.54,-1.27)
  round 1.7 hole 1.1: 2(-2.54,1.27) 3(0,-1.27) 4(0,1.27) 5(2.54,-1.27) 6(2.54,1.27)
HDR-TH_14P-P2.54-V-M
  rect 1.8x1.8 hole 1.1: 1(-16.51,0)
  round 1.8 hole 1.1: 2(-13.97,0) 3(-11.43,0) 4(-8.89,0) 5(-6.35,0) 6(-3.81,0) 7(-1.27,0) 8(1.27,0) 9(3.81,0) 10(6.35,0) 11(8.89,0) 12(11.43,0) 13(13.97,0) 14(16.51,0)
IND-SMD_L12.3-W12.3
  rect 2.9x5.4 smd: 1(-5.45,0) 2(5.45,0)
LED-TH_BD3.8-P2.54-FD_GREEN
  round 1.524 hole 0.9: 1(-1.27,0) 2(1.27,0)
LED-TH_BD3.8-P2.54-RD
  round 1.524 hole 0.9: 1(-1.27,0) 2(1.27,0)
Pad_e36
  round 3 hole 2: 1(0,0)
Pad_e40
  round 3 hole 2: 1(0,0)
Pad_e41
  round 3 hole 2: 1(0,0)
Pad_e42
  round 3 hole 2: 1(0,0)
RES-TH_BD2.4-L6.3-P10.30-D0.6
  round 1.3 hole 0.8: 1(-5.15,0) 2(5.15,0)
RES-TH_BD2.7-L6.2-P10.20-D0.4
  round 1.4 hole 0.8: 1(-5.1,0) 2(5.1,0)
SMA_L4.4-W2.8-LS5.4-RD
  rect 2.046x1.62 smd: 1(-2.566,0) 2(2.566,0)
SOT-223-3_L6.5-W3.4-P2.30-LS7.0-BR
  rect 2.5x1.1 smd: 1(2.97,-2.3) 2(2.97,0) 3(2.97,2.3)
  rect 2.34x3.6 smd: 4(-2.97,0)
SW-SMD_L3.9-W3.0-P4.45
  rect 1.23x1.36 smd: 1(-2.185,0) 2(2.185,0)
TO-263-5_L10.2-W8.6-P1.70-LS14.4-BR
  rect 3.5x1.02 smd: 1(5.127,-3.4) 2(5.127,-1.7) 3(5.127,0) 4(5.127,1.7) 5(5.127,3.4)
  rect 8.705x10.587 smd: 6(-5.127,0)

## Nets
As in the schematic.

Pads without a net: DC1 3; H8 2; NOREF 1; NOREF#2 1; NOREF#3 1; NOREF#4 1

## Via types
v1: diameter 0.61, hole 0.305, Top Layer to Bottom Layer, 38 vias

## Routing (per net, layer and track width the routed paths; a pad name or vN(x,y) marks a point on that pad's centre or on a via; arc(x,y) is an arc through that point)
+5V: length 259.5
  Top Layer w0.4: 62.71,45.47 H5.3 60.71,44.84 54.98,39.11 51.38,39.11 50.98,39.51 ; 62.71,45.47 H4.3 H3.3 ; 62.71,45.47 62.31,45.87 62.31,58.41 H10.2 63.26,62.06 H11.2 63.31,64.77 H12.2 H13.2 H14.2 63.26,73.09 H15.2 ; U2.4 8.59,37.19 11.05,39.65 14.25,39.65 U1.20 U1.21 21.74,44.45 ; v1(26.16,20.19) 23.11,23.24 L1.1 23.11,31.87 ; 28.71,37.47 21.74,44.45 ; 28.71,37.47 29.11,37.87 ; 28.71,37.47 23.11,31.87 ; 21.74,44.45 21.74,49.68 U1.7 ; v1(29.91,36.67) 29.11,37.47 29.11,37.87 ; v1(52.25,50.95) 51.85,50.55 H17.5 H17.4 H17.3 H17.2 H17.1 50.98,40.31 50.98,39.51 ; 29.11,37.87 29.58,38.34 U5.3 ; 50.98,39.51 50.98,38.31 49.78,37.11 45.48,37.11 v1(44.28,35.91) ; C3.1 23.11,31.87 ; v1(52.25,56.29) 52.25,56.97 H17.8 H17.9 H17.10 H17.11 H17.12 H17.13 H17.14
  Bottom Layer w0.4: H6.2 46.97,14.71 47.48,14.71 61.08,28.31 63.08,28.31 63.89,29.11 63.89,29.91 ; R2.1 65.99,19.06 65.99,27.99 H7.2 63.89,29.91 ; v1(29.91,36.67) 39.91,36.67 42.68,33.91 44.28,33.91 ; 63.89,29.91 61.08,32.71 46.28,32.71 LED2.1 44.28,33.91 ; 51.05,55.49 51.45,55.49 v1(52.25,56.29) ; 51.05,55.49 H17.6 52.25,51.89 v1(52.25,50.95) ; 51.05,55.49 H17.7 ; 44.28,33.91 v1(44.28,35.91) ; v1(26.16,20.19) H8.3
GND: length 284.5
  Top Layer w0.4: v1(50.17,38.8) 49.37,38 39.77,38 U6.2 39.24,37.73 36.98,37.73 ; v1(54.25,61.91) 54.25,65.39 H18.11 H18.12 H18.13 H18.14 ; H6.1 48.28,13.49 48.28,18.65 ; H6.1 46.53,11.74 32.84,11.74 H8.1 28.84,15.74 20.04,15.74 18.44,17.34 ; H6.1 54.2,13.34 SW1.2 64.39,17.12 H7.6 ; 36.98,37.73 36.98,26.7 U3.2 37.18,26.55 U7.1 48.28,18.65 ; 36.98,37.73 34.98,37.73 U5.1 31.86,40.85 27.33,40.85 v1(24.93,43.25) ; U2.6 12.44,22.95 12.44,23.34 ; 48.28,18.65 49.59,18.65 ; C3.2 22.13,39.28 v1(22.13,42.45) ; 12.44,23.34 10.44,25.34 10.44,29.34 ; 12.44,23.34 18.44,17.34 ; v1(58.65,50.41) 60.57,50.41 H5.1 60.71,50.15 v1(61.51,49.35) ; 18.44,17.34 16.84,17.34 9.71,10.21 9.71,8.2 ; 10.44,29.34 10.04,28.94 7.82,28.94 6.89,29.86 U2.5 6.89,38.03 D1.2 ; 10.44,29.34 10.44,30.91 U2.3
  Bottom Layer w0.4: 23.97,53.56 22.48,52.07 ; 23.97,53.56 23.97,55.96 21.03,58.91 C2.1 ; 23.97,53.56 24.37,53.56 C1.1 ; 22.48,52.07 22.48,46.1 U1.22 ; 22.48,52.07 U1.8 ; 53.85,50.41 H18.5 H18.6 H18.7 H18.8 H18.9 53.85,61.91 ; 53.85,50.41 v1(58.65,50.41) ; 53.85,50.41 H18.4 H18.3 H18.2 H18.1 52.26,38.8 v1(50.17,38.8) ; 65.63,50.55 H3.1 ; 65.63,50.55 65.63,59.19 H10.1 65.8,62.06 65.85,62.11 65.85,64.77 H12.1 H13.1 H14.1 65.8,73.09 H15.1 ; 65.63,50.55 H4.1 62.43,49.35 v1(61.51,49.35) ; U1.22 v1(22.13,42.45) ; U1.22 24.13,44.05 v1(24.93,43.25) ; 53.85,61.91 v1(54.25,61.91) ; 53.85,61.91 H18.10
VCC: length 45.8
  Top Layer w0.4: U3.1 27.17,18.15 16.52,28.8 v1(13.71,28.8) 13.71,31.04 U2.1
  Bottom Layer w0.4: v1(13.71,28.8) 13.71,28.4 9.71,24.4 9.71,14.4
+3.3: length 53.5
  Top Layer w0.4: U5.2 U5.4 v1(36.08,32.59) ; v1(37.68,32.59) U6.1 43.63,34.28 44.83,35.48 58.43,35.48 62.03,39.08 v1(62.03,44.81)
  Bottom Layer w0.4: v1(37.68,32.59) v1(36.08,32.59) ; 62.03,48.01 60.71,48.01 ; 62.03,48.01 66.55,48.01 ; 62.03,48.01 v1(62.03,44.81)
A0: length 56.2
  Top Layer w0.4: H10.3 56.32,54.96 56.32,43.54 54.42,41.65 v1(52.42,41.65)
  Bottom Layer w0.4: v1(52.42,41.65) 49.92,41.65 49.62,41.36 49.62,39.25 49.22,38.85 45.62,38.85 40.82,43.65 40.82,44.85 40.02,45.65 36.02,45.65 35.62,45.25 35.62,44.05 34.82,43.25 27.87,43.25 U1.23
A1: length 48.1
  Top Layer w0.4: U1.24 30.87,46.11 v1(35.17,46.11)
  Bottom Layer w0.4: v1(35.17,46.11) 38.37,49.31 48.77,49.31 49.57,50.11 49.57,56.11 50.37,56.91 51.97,56.91 52.37,57.31 52.37,63.71 53.17,64.51 58.37,64.51 H11.3
A2: length 70.5
  Top Layer w0.4: v1(35.12,47.25) 30.32,47.25 27.92,44.85 27.92,44.05 28.72,43.25 30.55,43.25 U1.25 ; v1(42.72,50.05) 46.72,46.05 46.72,39.42 47.12,39.02 49.22,39.02 49.52,39.31 49.52,51.02 50.32,51.82 54.72,51.82 55.12,52.22 55.12,59.22 H12.3
  Bottom Layer w0.4: v1(42.72,50.05) 37.92,50.05 v1(35.12,47.25)
A3: length 45.4
  Bottom Layer w0.4: H13.3 58.72,69.61 50.32,69.61 49.52,68.81 49.52,62.41 49.12,62.01 45.12,62.01 35.52,52.41 35.52,51.61 34.29,50.39 U1.26
D0_RX: length 62.9
  Top Layer w0.4: v1(29.08,36.54) 27.48,34.94 v1(27.48,22.54) ; U1.2 38.03,50.87 38.03,43.99 37.23,43.19 37.23,42.79 39.88,40.14 v1(40.68,40.14) 43.88,40.14 v1(45.08,41.34)
  Bottom Layer w0.4: H8.5 21.08,16.14 v1(27.48,22.54) ; v1(40.68,40.14) 32.28,40.14 29.08,36.94 v1(29.08,36.54) ; H16.1 47.36,41.34 v1(45.08,41.34)
D1_TX: length 69
  Top Layer w0.4: v1(31.22,18.94) 29.62,20.54 29.62,34.14 30.82,35.34 v1(30.82,39.74) ; v1(38.06,42.98) 44.46,42.98 v1(44.86,43.38) ; v1(35.62,42.94) 35.62,45.34 36.02,45.74 36.02,50.34 U1.3
  Bottom Layer w0.4: H16.2 47.06,44.18 45.66,44.18 v1(44.86,43.38) ; v1(38.06,42.98) 38.02,42.94 v1(35.62,42.94) 35.22,42.54 33.62,42.54 v1(30.82,39.74) ; v1(31.22,18.94) 32.82,17.34 32.82,12.54 32.02,11.74 25.22,11.74 H8.4
D2: length 20.2
  Top Layer w0.4: H16.3 40.5,53.27 32.95,53.27 U1.4
D3: length 22.4
  Top Layer w0.4: H16.4 42.26,54.06 31.2,54.06 U1.5
D4: length 24.5
  Top Layer w0.4: U1.6 27.18,52.07 29.98,54.87 43.98,54.87 H16.5
D5: length 36.7
  Top Layer w0.4: U1.11 15.44,53.54 27.86,53.54 29.86,55.54 45.86,55.54 H16.6
D6: length 42.6
  Top Layer w0.4: U1.12 13.84,54.48 19.86,54.48 24.66,59.28 28.26,59.28 29.86,60.88 43.06,60.88 H16.7
D7: length 46.4
  Top Layer w0.4: U1.13 8.89,54.05 17.06,62.22 44.26,62.22 H16.8
D8: length 47.7
  Top Layer w0.4: H16.9 45.86,63.16 17.06,63.16 6.35,52.45 U1.14
D9: length 57
  Top Layer w0.4: H16.10 47.46,64.1 16.4,64.1 5.2,52.9 5.2,45.6 U1.15
D10_SS: length 99.8
  Top Layer w0.4: v1(19.45,45.74) 18.65,45.74 17.85,44.94 17.85,44.14 15.85,42.14 v1(12.25,42.14) 11.2,42.14 U1.16 ; H6.3 41.05,15.34 v1(39.05,15.34)
  Bottom Layer w0.4: v1(39.05,15.34) v1(12.25,42.14) ; H16.11 47.36,64.94 45.45,64.94 33.05,52.54 33.05,51.74 31.85,50.54 31.05,50.54 25.45,44.94 25.45,43.74 25.85,43.34 25.85,42.94 24.65,41.74 21.85,41.74 20.25,43.34 20.25,44.94 v1(19.45,45.74)
D11_MOSI: length 131.7
  Bottom Layer w0.4: H16.12 47.06,69.58 45.36,69.58 36.23,60.45 15.03,60.45 12.63,58.05 12.63,45.65 U1.17 11.43,39.88 H6.5 39.57,11.74 51.07,11.74 63.17,23.84 63.17,25.84 H7.4
D12_MISO: length 117.7
  Top Layer w0.4: v1(29.31,61.34) 25.71,61.34 v1(20.51,56.14)
  Bottom Layer w0.4: U1.18 14.11,44.31 14.11,44.14 ; 42.91,15.34 40.91,13.34 H6.4 ; 42.91,15.34 14.11,44.14 ; 42.91,15.34 44.91,17.34 45.31,17.34 57.57,29.59 61.85,29.59 ; H16.13 47.47,70.14 38.11,70.14 v1(29.31,61.34) ; 14.11,44.14 17.71,47.74 17.71,53.34 v1(20.51,56.14)
D13_SCK: length 148.2
  Top Layer w0.4: 59.32,27.05 61.85,27.05 ; 59.32,27.05 58.92,27.05 53.03,32.94 49.43,32.94 ; 59.32,27.05 59.32,31.45 68.92,41.05 68.92,72.4 66.12,75.2 50,75.2 H16.14 ; v1(41.43,20.94) 41.43,18.94 35.83,13.34 H6.6 ; 49.43,32.94 48.23,31.74 v1(48.23,30.94) ; 49.43,32.94 49.43,33.81 LED1.2
  Bottom Layer w0.4: v1(48.23,30.94) 48.23,27.74 v1(41.43,20.94) 40.02,20.94 U1.19
DTR_RESET: length 68.5
  Top Layer w0.4: SW1.1 57.4,20.07 60.65,23.31 ; 61.85,24.51 60.65,23.31 ; 60.65,23.31 53.85,30.11 47.85,30.11 46.25,31.71 v1(46.25,34.51) ; v1(41.85,38.91) 43.85,38.91 45.85,40.91 45.85,45.59 U1.1
  Bottom Layer w0.4: R2.2 54.68,17.34 61.85,24.51 ; v1(46.25,34.51) 46.25,34.91 42.25,38.91 v1(41.85,38.91)
SCL: length 71.6
  Top Layer w0.4: H3.5 68.15,41.99 68.15,51.19 64.55,54.79 64.55,73.8 63.75,74.6 62.22,74.6 H15.3
  Bottom Layer w0.4: H3.5 H4.5 H5.5 58.31,37.99 45.03,37.99 39.37,43.65 U1.28
SDA: length 77.8
  Bottom Layer w0.4: 61.35,42.93 59.35,44.93 59.35,53.73 64.55,58.93 64.55,68.13 63.75,68.93 62.2,68.93 H14.3 ; 61.35,42.93 H4.4 67.08,42.93 67.95,42.05 67.95,40.05 65.15,37.25 44.75,37.25 37.55,44.45 U1.27 ; 61.35,42.93 H5.4
$1N1105: length 25.7
  Top Layer w0.4: D1.1 12.47,31.54 U2.2 11.99,29.46 23.11,18.34 L1.2
$1N3764: length 9.5
  Bottom Layer w0.4: 16.51,55.27 U1.10 ; 16.51,55.27 17.8,55.27 U4.1 ; 16.51,55.27 C2.2
$1N3766: length 13.6
  Top Layer w0.4: v1(21.46,54.44) 24.66,57.64 U4.2 26.04,56.66 C1.2
  Bottom Layer w0.4: v1(21.46,54.44) 21.42,54.44 U1.9
$1N5673: length 2.5
  Bottom Layer w0.4: LED2.2 U7.2
$1N5768: length 2.7
  Bottom Layer w0.4: R1.2 49.66,28.92 LED1.1

## Copper pours and planes (outline as drawn; the poured copper is in the pictures)
GND on Top Layer: -1.27,78.43 76.33,78.43 76.33,-1.84 -1.27,-1.84
GND on Bottom Layer: -2.03,79.82 76.58,79.82 76.58,-1.46 -2.03,-1.46

## Text on the board
Bottom Layer: D12 | D10 | D9 | D8 | D6 | D4 | D13 | D11 | D7 | D5 | D3 | D2 | D1 | D0
Bottom Silkscreen Layer: +5v | GND | A5 | A4 | A2 | A0 | A3 | A1 | https://electroiot.in | electroiot.in@gmail.com | https://github.com/ElectroIoT | https://www.youtube.com/@ElectroIoT-IN | Digital | Analog
Top Layer: MANORANJAN
Top Silkscreen Layer: D12 | D10 | D13 | D11 | D9 | D8 | D7 | D6 | D5 | D4 | D3 | D2 | D0 | D1 | +5v | GND | A5 | A4 | A2 | A0 | A3 | A1 | Reset | MISO | SCK | MOSI | +5V | SCL | +3.3V | SDA | FTDI | SPI | EasyArduino | Digital | Analog | ISP | I2C | DTR | RX | TX | NC | SS | DC 7-30v
